# Altium project SysP18_Team10.PrjPcb
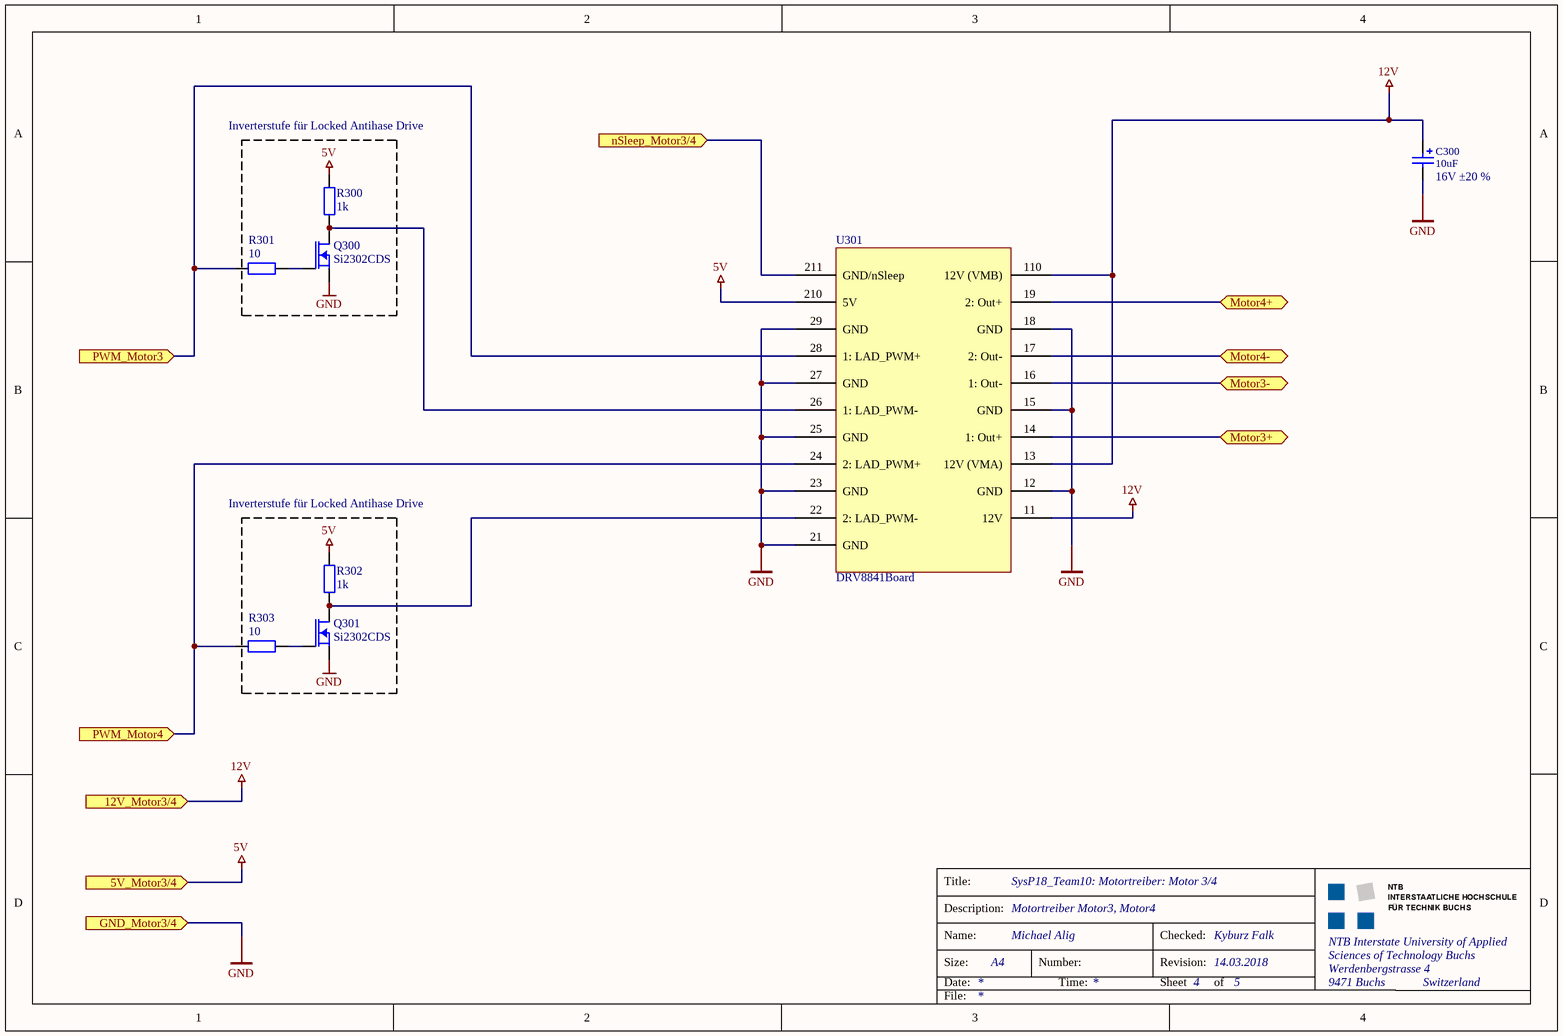
[diagram p0: Motortreiber_3,4.SchDoc]
2 sheets, 17 parts. Net scope: flat (ports and power ports of the same name join across sheets).
Board file: PCB.PcbDoc
Sheets:
  Motortreiber_3,4.SchDoc
  Motortreiber_5,6.SchDoc

## Sheet Motortreiber_3,4.SchDoc: SysP18_Team10: Motortreiber: Motor 3/4
size A4; CheckedBy: Kyburz Falk; Author: Michael Alig; CompanyName: NTB; Organization: NTB Interstate University of Applied; Address1: Werdenbergstrasse 4; Address3: 9471 Buchs; Address4: Switzerland; Revision: 14.03.2018; SheetNumber: 4; SheetTotal: 5; Organization1: Sciences of Technology Buchs; Size: A4; ShortDescription: Motortreiber Motor3, Motor4

### Parts
C300  value 10uF  ValueAddon: 16V ±20 %  [CDE_CAP AVE CODE D_H]  (hidden comment: AVE476M16D16T-F)
Q300  Si2302CDS  [SOT23-3]
Q301  Si2302CDS  [SOT23-3]
R300  value 1k  [GEN_R0805_H]  (hidden comment: Generic)
R301  value 10  [GEN_R0805_H]  (hidden comment: Generic)
R302  value 1k  [GEN_R0805_H]  (hidden comment: Generic)
R303  value 10  [GEN_R0805_H]  (hidden comment: Generic)
U301  DRV8841Board  [DRV8841_Board]

### Ports
5V_Motor3/4 (in), 12V_Motor3/4 (in), GND_Motor3/4 (in), Motor3+, Motor3-, Motor4+, Motor4-, nSleep_Motor3/4 (in), PWM_Motor3 (in), PWM_Motor4 (in)

### Nets
5V: R300.2 R302.2 U301.210(5V) ; port 5V_Motor3/4
12V: C300.1(Pos) U301.11(12V) U301.13(12V_(VMA)) U301.110(12V_(VMB)) ; port 12V_Motor3/4
GND: C300.2(Neg) Q300.2(S) Q301.2(S) U301.12(GND) U301.15(GND) U301.18(GND) U301.21(GND) U301.23(GND) U301.25(GND) U301.27(GND) U301.29(GND) ; port GND_Motor3/4
NetQ300_1: Q300.1(G) R301.2
NetQ300_3: Q300.3(D) R300.1 U301.26(1:_LAD_PWM-)
NetQ301_1: Q301.1(G) R303.2
NetQ301_3: Q301.3(D) R302.1 U301.22(2:_LAD_PWM-)
NetR301_1: R301.1 U301.28(1:_LAD_PWM+) ; port PWM_Motor3
NetR303_1: R303.1 U301.24(2:_LAD_PWM+) ; port PWM_Motor4
NetU301_14: U301.14(1:_Out+) ; port Motor3+
NetU301_16: U301.16(1:_Out-) ; port Motor3-
NetU301_17: U301.17(2:_Out-) ; port Motor4-
NetU301_19: U301.19(2:_Out+) ; port Motor4+
NetU301_211: U301.211(GND/nSleep) ; port nSleep_Motor3/4

### Notes on the sheet
- Inverterstufe für Locked Antihase Drive
- Title:
- Description:
- Size:
- Date:
- Name:
- Number:
- Time:
- Revision:
- Sheet
- Checked:
- of
- File:

### Library data of the parts
C300 = CDE_AVE476M16D16T-F_AVE CODE D: Aluminum Electrolytic Capacitors for Filtering and Bypass, 47uF, 16V; Manufacturer: Cornell Dubilier; #Class: PASSIVE; RefFootprint: CDE_CAP AVE CODE D; #ClassSub: CAPACITOR; Distributor PartNr: 598-AVE476M16D16T-F; Distributor: Mouser; Published: 20121220; Publisher: Stefan Ursella, M.Eng; ComponentLink1Description: Manufacturer Link; ComponentLink2Description: Datasheet; ComponentLink2URL: http://www.cde.com/catalogs/AVE.pdf; ComponentLink3Description: Packaging Specification; Manufacturer PartNr: AVE476M16D16T-F; RefFileFOO: *; RefFileSCH: *; RefSchema: CDE_AVE476M16D16T-F_AVE CODE D
Q300 Q301 = Depletion Mode MOSFET: N-Channel 20V (D-S) MOSFET; ID: 2.9A; RDSON: 57mR; VDSS: 20V; ComponentLink1Description: Datasheet Si2302CDS; ComponentLink1URL: V:\MosFets\si2302cds.pdf
R300-R303 = GEN_R_2: generic resistor; Manufacturer: Tbd; #Class: PASSIVE; Published: 8-Jun-2000; Publisher: Altium Limited; #ClassSub: RESISTOR; ComponentLink1Description: Manufacturer Link; ComponentLink2Description: Datasheet; ComponentLink3Description: Packaging Specification; Distributor: tbd; RefFootprint: GEN_R0805_H; Manufacturer PartNr: tbd; Distributor PartNr: tbd; RefFileFOO: *; RefFileSCH: *; RefSchema: GEN_R_2
U301 = DRV8841_Board

## Sheet Motortreiber_5,6.SchDoc: SysP18_Team10: Motortreiber 5/6
size A4; Author: Michael Alig; CompanyName: NTB; Organization: NTB Interstate University of Applied; Address1: Werdenbergstrasse 4; Address3: 9471 Buchs; Address4: Switzerland; SheetNumber: 5; SheetTotal: 5; Organization1: Sciences of Technology Buchs; Size: A4; ShortDescription: Motortreiber Motor 5, Motor6
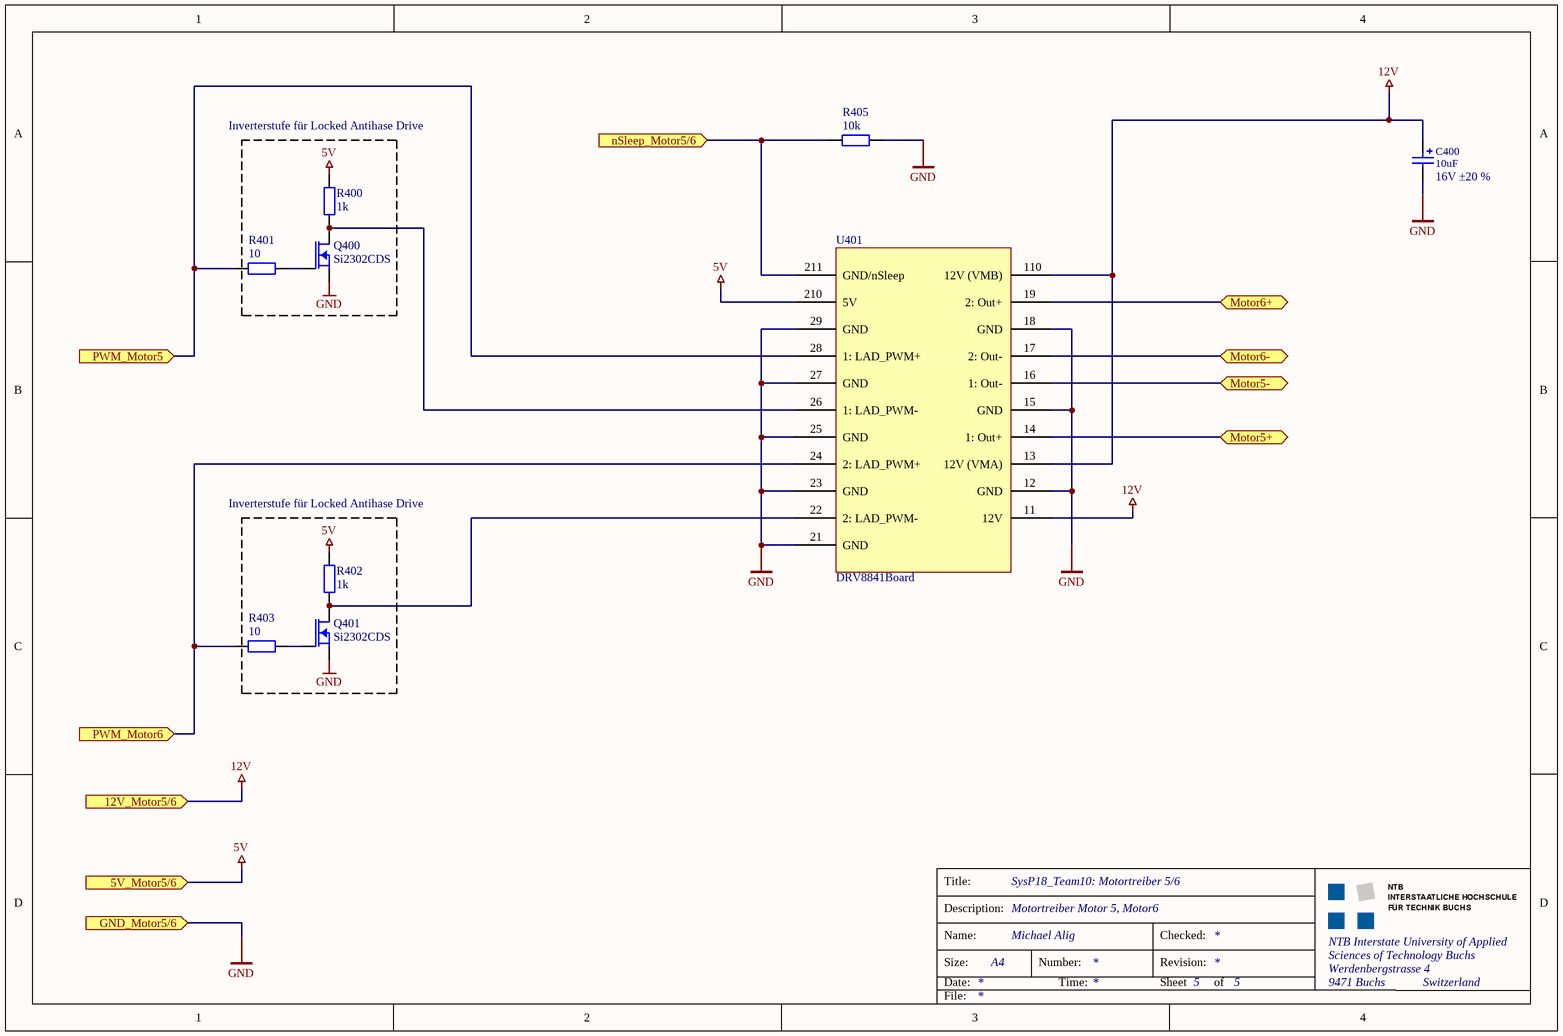
[diagram p1: Motortreiber_5,6.SchDoc]

### Parts
C400  value 10uF  ValueAddon: 16V ±20 %  [CDE_CAP AVE CODE D_H]  (hidden comment: AVE476M16D16T-F)
Q400  Si2302CDS  [SOT23-3]
Q401  Si2302CDS  [SOT23-3]
R400  value 1k  [GEN_R0805_H]  (hidden comment: Generic)
R401  value 10  [GEN_R0805_H]  (hidden comment: Generic)
R402  value 1k  [GEN_R0805_H]  (hidden comment: Generic)
R403  value 10  [GEN_R0805_H]  (hidden comment: Generic)
R405  value 10k  [GEN_R0805_H]  (hidden comment: Generic)
U401  DRV8841Board  [DRV8841_Board]

### Ports
5V_Motor5/6 (in), 12V_Motor5/6 (in), GND_Motor5/6 (in), Motor5+, Motor5-, Motor6+, Motor6-, nSleep_Motor5/6 (in), PWM_Motor5 (in), PWM_Motor6 (in)

### Nets
5V: R400.2 R402.2 U401.210(5V) ; port 5V_Motor5/6
12V: C400.1(Pos) U401.11(12V) U401.13(12V_(VMA)) U401.110(12V_(VMB)) ; port 12V_Motor5/6
GND: C400.2(Neg) Q400.2(S) Q401.2(S) R405.2 U401.12(GND) U401.15(GND) U401.18(GND) U401.21(GND) U401.23(GND) U401.25(GND) U401.27(GND) U401.29(GND) ; port GND_Motor5/6
NetQ400_1: Q400.1(G) R401.2
NetQ400_3: Q400.3(D) R400.1 U401.26(1:_LAD_PWM-)
NetQ401_1: Q401.1(G) R403.2
NetQ401_3: Q401.3(D) R402.1 U401.22(2:_LAD_PWM-)
NetR401_1: R401.1 U401.28(1:_LAD_PWM+) ; port PWM_Motor5
NetR403_1: R403.1 U401.24(2:_LAD_PWM+) ; port PWM_Motor6
NetR405_1: R405.1 U401.211(GND/nSleep) ; port nSleep_Motor5/6
NetU401_14: U401.14(1:_Out+) ; port Motor5+
NetU401_16: U401.16(1:_Out-) ; port Motor5-
NetU401_17: U401.17(2:_Out-) ; port Motor6-
NetU401_19: U401.19(2:_Out+) ; port Motor6+

### Notes on the sheet
- Inverterstufe für Locked Antihase Drive
- Title:
- Description:
- Size:
- Date:
- Name:
- Number:
- Time:
- Revision:
- Sheet
- Checked:
- of
- File:

### Library data of the parts
C400 = CDE_AVE476M16D16T-F_AVE CODE D: as C300 on sheet Motortreiber_3,4; #ClassSub: CAPACITOR; Distributor PartNr: 598-AVE476M16D16T-F; Distributor: Mouser; Published: 20121220; Publisher: Stefan Ursella, M.Eng; ComponentLink1Description: Manufacturer Link; ComponentLink2Description: Datasheet; ComponentLink2URL: http://www.cde.com/catalogs/AVE.pdf; ComponentLink3Description: Packaging Specification; Manufacturer PartNr: AVE476M16D16T-F; RefFileFOO: *; RefFileSCH: *; RefSchema: CDE_AVE476M16D16T-F_AVE CODE D
Q400 Q401 = Depletion Mode MOSFET: as Q300 on sheet Motortreiber_3,4; VDSS: 20V; ComponentLink1Description: Datasheet Si2302CDS; ComponentLink1URL: V:\MosFets\si2302cds.pdf
R400-R403 R405 = GEN_R_2: as R300 on sheet Motortreiber_3,4; Published: 8-Jun-2000; Publisher: Altium Limited; #ClassSub: RESISTOR; ComponentLink1Description: Manufacturer Link; ComponentLink2Description: Datasheet; ComponentLink3Description: Packaging Specification; Distributor: tbd; RefFootprint: GEN_R0805_H; Manufacturer PartNr: tbd; Distributor PartNr: tbd; RefFileFOO: *; RefFileSCH: *; RefSchema: GEN_R_2
U401 = DRV8841_Board

## Nets that join several sheets
5V: Motortreiber_3,4 (R300.2 R302.2 U301.210), Motortreiber_5,6 (R400.2 R402.2 U401.210)
12V: Motortreiber_3,4 (C300.1 U301.11 U301.13 U301.110), Motortreiber_5,6 (C400.1 U401.11 U401.13 U401.110)
GND: Motortreiber_3,4 (11 pins), Motortreiber_5,6 (12 pins)